# Altium schematic sheet MIC2.SchDoc: Mic
size A4; Organization: Autobot Limited; Address1: 96, boulevard Bessiere; Address4: 75017 PARIS; SheetNumber: 4
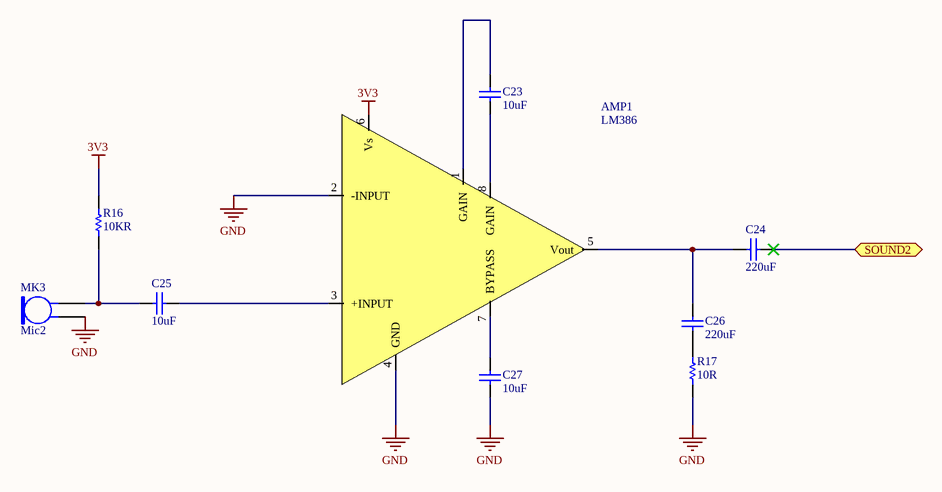
[diagram p0: MIC2.SchDoc]

## Parts
AMP1  LM386  [Ampli]
C23  10uF  [CAPC1608N]
C24  220uF  [CAPC1608N]
C25  10uF  [CAPC1608N]
C26  220uF  [CAPC1608N]
C27  10uF  [CAPC1608N]
MK3  Mic2  [PIN2]
R16  10KR  [RESC1608N]
R17  10R  [RESC1608N]

## Ports
SOUND2

## Nets
3V3: AMP1.6(Vs) R16.1
GND: AMP1.2(-INPUT) AMP1.4(GND) C27.2 MK3.1 R17.2
SOUND2: C24.1 ; port SOUND2
NetAMP1_1: AMP1.1(GAIN) C23.1
NetAMP1_3: AMP1.3(+INPUT) C25.1
NetAMP1_5: AMP1.5(Vout) C24.2 C26.1
NetAMP1_7: AMP1.7(BYPASS) C27.1
NetAMP1_8: AMP1.8(GAIN) C23.2
NetC25_2: C25.2 MK3.2 R16.2
NetC26_2: C26.2 R17.1

## Notes on the sheet
- Title
- Size:
- Date:
- A4
- Number:
- Time:
- Revision:
- Sheet
- of
- File:

## Library data of the parts
C23-C27 = Cap: Capacitor; Published: 8-Jun-2000; LatestRevisionDate: 17-Jul-2002; LatestRevisionNote: Re-released for DXP Platform.; PackageReference: RAD-0.3; Publisher: Altium Limited; PackageDescription: Radial Cap, Thru-Hole; 2 Leads; 0.3 in Pin Spacing
  C23 C25 C27: Value: 10uF
  C24 C26: Value: 220uF
MK3 = Mic2: Microphone; Fabricant: PRO SIGNAL; Fournisseur: Farnell; RefFabricant: ABM-708-RC; RefFournisseur: 1736564; Published: 24-Mar-1999; LatestRevisionDate: 17-Jul-2002; LatestRevisionNote: Re-released for DXP Platform.; PackageReference: PIN2; Publisher: Altium Limited
R16 R17 = Res1: Resistor; Published: 8-Jun-2000; LatestRevisionDate: 17-Jul-2002; LatestRevisionNote: Re-released for DXP Platform.; PackageReference: AXIAL-0.3; Publisher: Altium Limited; PackageDescription: Axial Device, Thru-Hole; 2 Leads; 0.3 in Pin Spacing
  R16: Value: 10KR
  R17: Value: 10R